# EAGLE design Interconnect_board_limit_switches_v1p3 (EAGLE 9.4.2)
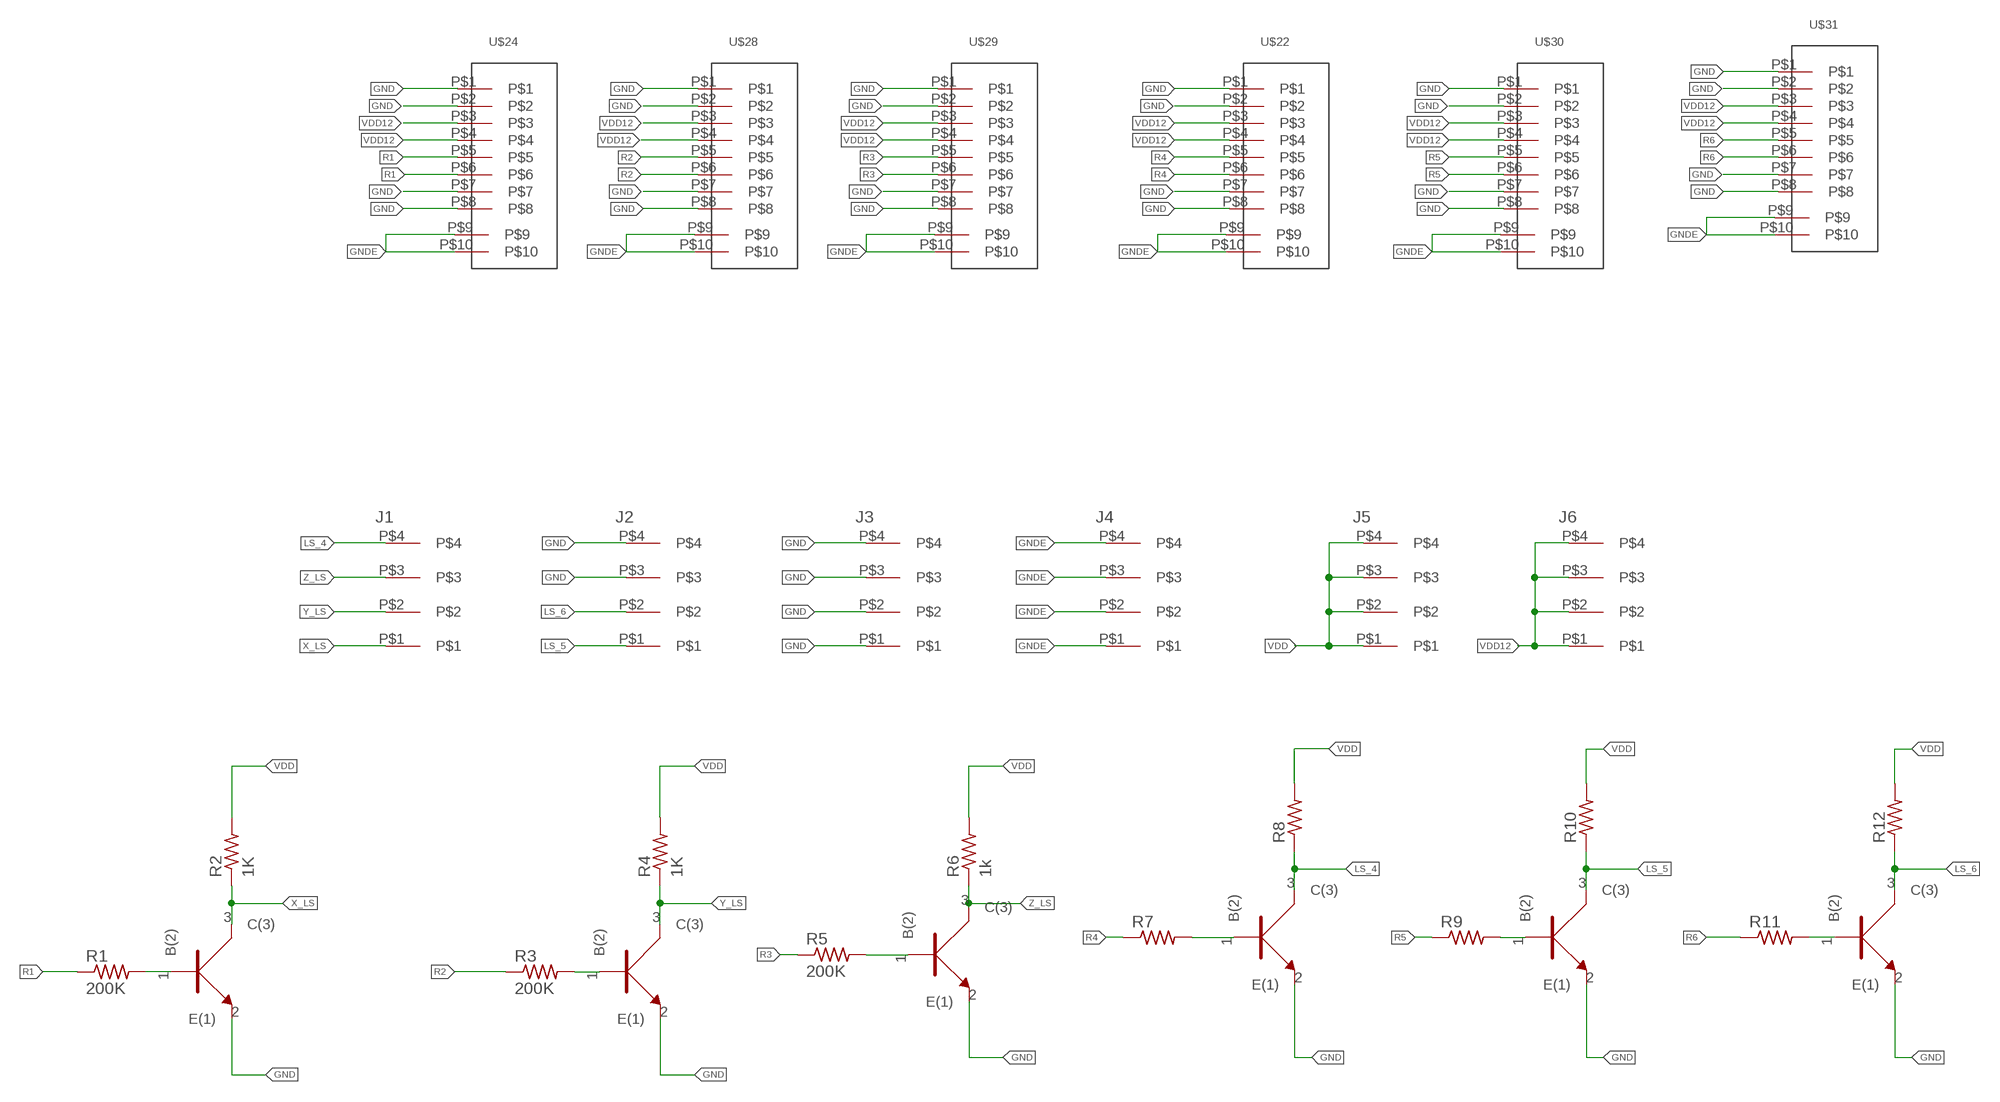
[diagram p0: schematic, sheet 1]

## Parts
J1  3.81MM_1_X_4_RT_ANGLE_PLUG_HEADER  [1X4_3.81MM_PITCH]
J2  3.81MM_1_X_4_RT_ANGLE_PLUG_HEADER  [1X4_3.81MM_PITCH]
J3  3.81MM_1_X_4_RT_ANGLE_PLUG_HEADER  [1X4_3.81MM_PITCH]
J4  3.81MM_1_X_4_RT_ANGLE_PLUG_HEADER  [1X4_3.81MM_PITCH]
J5  3.81MM_1_X_4_RT_ANGLE_PLUG_HEADER  [1X4_3.81MM_PITCH]
J6  3.81MM_1_X_4_RT_ANGLE_PLUG_HEADER  [1X4_3.81MM_PITCH]
R1  200K  R_0805  [0805]
R2  1K  R_0805  [0805]
R3  200K  R_0805  [0805]
R4  1K  R_0805  [0805]
R5  200K  R_0805  [0805]
R6  1k  R_0805  [0805]
R7  R_0805  [0805]
R8  R_0805  [0805]
R9  R_0805  [0805]
R10  R_0805  [0805]
R11  R_0805  [0805]
R12  R_0805  [0805]
U1  BC846BW  [SOT323]
U2  BC846BW  [SOT323]
U3  BC846BW  [SOT323]
U4  BC846BW  [SOT323]
U5  BC846BW  [SOT323]
U6  BC846BW  [SOT323]
U$22  RJ45_SMTRJ  [RJ45_SMT]
U$24  RJ45_SMTRJ  [RJ45_SMT]
U$28  RJ45_SMTRJ  [RJ45_SMT]
U$29  RJ45_SMTRJ  [RJ45_SMT]
U$30  RJ45_SMTRJ  [RJ45_SMT]
U$31  RJ45_SMTRJ  [RJ45_SMT]

## Nets
GND: J2.P$3 J2.P$4 J3.P$1 J3.P$2 J3.P$3 J3.P$4 U1.2(E(1)) U2.2(E(1)) U3.2(E(1)) U4.2(E(1)) U5.2(E(1)) U6.2(E(1)) U$22.P$1 U$22.P$2 U$22.P$7 U$22.P$8 U$24.P$1 U$24.P$2 U$24.P$7 U$24.P$8 U$28.P$1 U$28.P$2 U$28.P$7 U$28.P$8 U$29.P$1 U$29.P$2 U$29.P$7 U$29.P$8 U$30.P$1 U$30.P$2 U$30.P$7 U$30.P$8 U$31.P$1 U$31.P$2 U$31.P$7 U$31.P$8
GNDE: J4.P$1 J4.P$2 J4.P$3 J4.P$4 U$22.P$9 U$22.P$10 U$24.P$9 U$24.P$10 U$28.P$9 U$28.P$10 U$29.P$9 U$29.P$10 U$30.P$9 U$30.P$10 U$31.P$9 U$31.P$10
LS_4: J1.P$4 R8.1 U4.3(C(3))
LS_5: J2.P$1 R10.1 U5.3(C(3))
LS_6: J2.P$2 R12.1 U6.3(C(3))
N$1: R1.2 U1.1(B(2))
N$5: R3.2 U2.1(B(2))
N$11: R5.2 U3.1(B(2))
N$17: R7.2 U4.1(B(2))
N$22: R9.2 U5.1(B(2))
N$27: R11.2 U6.1(B(2))
R1: R1.1 U$24.P$5 U$24.P$6
R2: R3.1 U$28.P$5 U$28.P$6
R3: R5.1 U$29.P$5 U$29.P$6
R4: R7.1 U$22.P$5 U$22.P$6
R5: R9.1 U$30.P$5 U$30.P$6
R6: R11.1 U$31.P$5 U$31.P$6
VDD: J5.P$1 J5.P$2 J5.P$3 J5.P$4 R2.2 R4.2 R6.2 R8.2 R10.2 R12.2
VDD12: J6.P$1 J6.P$2 J6.P$3 J6.P$4 U$22.P$3 U$22.P$4 U$24.P$3 U$24.P$4 U$28.P$3 U$28.P$4 U$29.P$3 U$29.P$4 U$30.P$3 U$30.P$4 U$31.P$3 U$31.P$4
X_LS: J1.P$1 R2.1 U1.3(C(3))
Y_LS: J1.P$2 R4.1 U2.3(C(3))
Z_LS: J1.P$3 R6.1 U3.3(C(3))

## Library data of the parts
J1-J6 = 3D_MIG_Controller:3.81MM_1_X_4_RT_ANGLE_PLUG_HEADER
R1-R12 = 3D_MIG_Controller:R_0805
U1-U6 = 3D_MIG_Controller:BC846BW; MANUFACTURER_PART_NUMBER: BC846BW; VENDOR: Nexperia
U$22 U$24 U$28-U$31 = 3D_MIG_Controller:RJ45_SMT

## Board
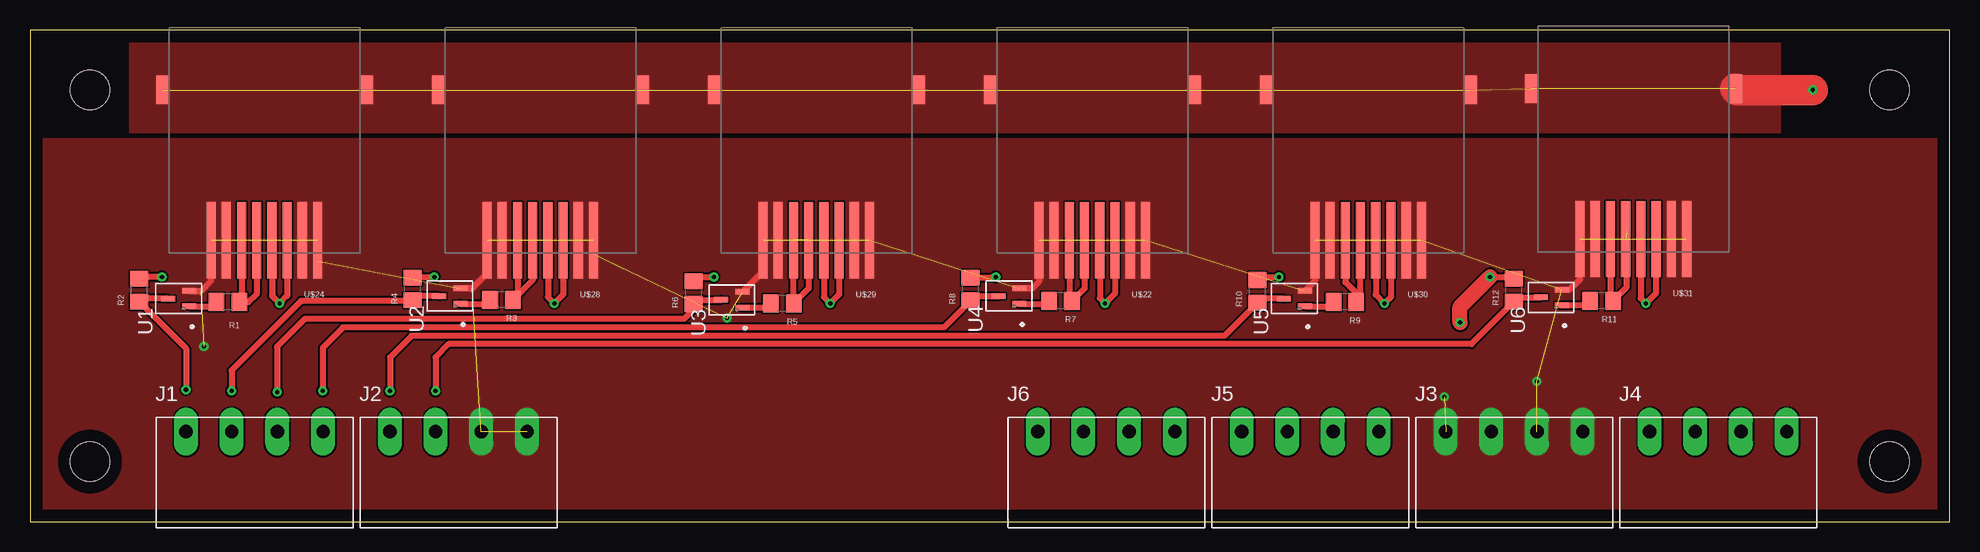
[diagram p1: board, top side]
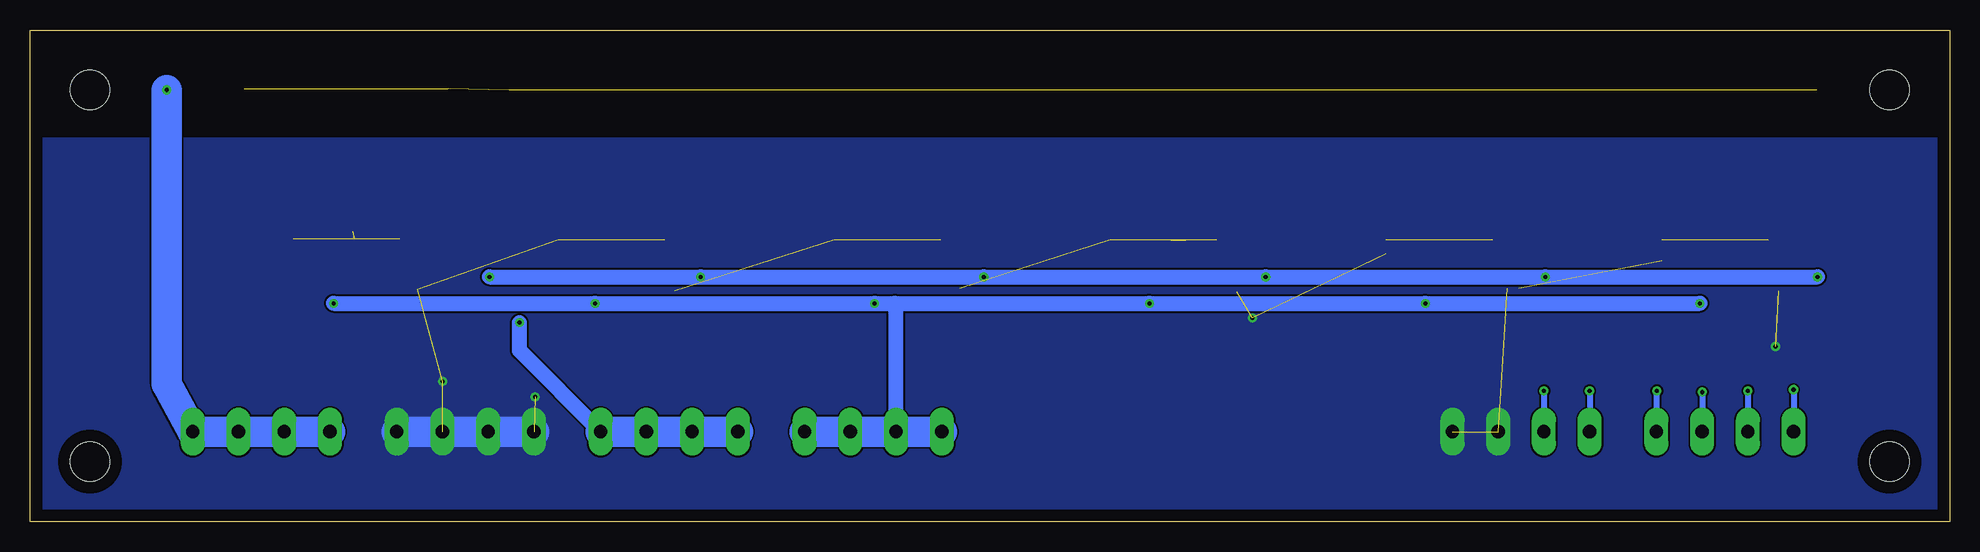
[diagram p2: board, bottom side, seen from below]

Size 160 x 41 mm. Coordinates in mm from the lower left corner, seen from the top.
Outline: 0,0 160,0 160,41 0,41 0,0
Copper layers (1*16): Top 0.035mm / dielectric 1.5mm / Bottom 0.035mm
Design rules "default": minimum track width 6mil, minimum drill 0.35mm, track to track 6mil, track to pad 6mil, pad to pad 6mil, via to via 6mil, smd to smd 6mil, copper to edge 40mil, drill to drill 6mil, minimum pad ring 10mil, minimum via ring 8mil, stop-mask expansion 4mil, vias tented up to drill 0mil, thermal gap 10mil
Holes 3.3 mm at 5,36 5,5 155,5 155,36

### Footprints (pad centres in the part's own frame; a part is rotated, then mirrored left to right if it is on the bottom)
1X4_3.81MM_PITCH = drill 1.1 pad 2 long: P$1 0,0; P$2 3.81,0; P$3 7.62,0; P$4 11.43,0
0805 = smd 1.3 x 1.5: 1 -0.95,0; 2 0.95,0
SOT323 = smd 0.457 x 1.168: 1 -0.65,-0.876; 2 0.65,-0.876; 3 0,0.876
RJ45_SMT = smd 0.76 x 6.35: P$1 -3.18,8.94; P$2 -1.91,8.94; P$3 -0.64,8.94; P$4 0.63,8.94; P$5 1.9,8.94; P$6 3.17,8.94; P$7 4.44,8.94; P$8 5.71,8.94 | smd 1.1 x 2.4: P$9 -7.25,-3.6; P$10 9.75,-3.6

### Placement (x,y rotation side)
J1  13,7.5 0 top
J2  30,7.5 0 top
J3  118,7.5 0 top
J4  135,7.5 0 top
J5  101,7.5 0 top
J6  84,7.5 0 top
R1  16.5,18.3 180 top
R2  9.1,19.3 90 top
R3  39.3,18.5 180 top
R4  31.9,19.4 90 top
R5  62.7,18.2 180 top
R6  55.3,19.1 90 top
R7  85.9,18.4 180 top
R8  78.4,19.4 90 top
R9  109.6,18.3 180 top
R10  102.3,19.2 90 top
R11  131,18.4 180 top
R12  123.7,19.3 90 top
U1  12.4,18.6 90 top
U2  35,18.8 90 top
U3  58.5,18.5 90 top
U4  81.6,18.8 90 top
U5  105.4,18.6 90 top
U6  126.8,18.7 90 top
U$22  89.8,32.4 180 top
U$24  20.8,32.4 180 top
U$28  43.8,32.4 180 top
U$29  66.8,32.4 180 top
U$30  112.8,32.4 180 top
U$31  134.9,32.5 180 top

### Tracks (layer width: path | path; a pad name or v marks a point on that pad's centre or on a via)
GND  (via drill 0.35)  (30 unrouted)
  Top 0.152: U$28.P$1 46.98,22.32 | U$24.P$1 23.98,21.72 | U$30.P$8 107.09,20.39 | U$31.P$8 129.19,21.39
  Top 0.508: U$30.P$8 107.09,20.06 U5.2 | U6.2 128.35,19.35 129.19,20.19 U$31.P$8 | U3.2 61.09,20.86 U$29.P$8 | U1.2 14.25,19.25 15.09,20.09 U$24.P$8 15.09,24.7 | U$28.P$8 38.09,20.69 36.85,19.45 U2.2 | U$22.P$8 84.09,19.99 83.55,19.45 U4.2 | U$29.P$1 69.98,25.5 | U$30.P$1 115.98,23.6
  Bottom 2.54: J3.P$1 J3.P$2 J3.P$3 J3.P$4
  other vias: 125.6,11.7 117.9,10.4 14.5,14.6 58.1,16.98
  pour Top (no thermals): 0,32 160,32 160,0 0,0
  pour Bottom (no thermals): 0,32 160,32 160,0 0,0
GNDE  (via drill 0.35)  (11 unrouted)
  Top 2.54: v148.6,36 142.25,36 U$31.P$9
  Bottom 2.54: J4.P$1 J4.P$2 J4.P$3 J4.P$4 148.6,11.47 v148.6,36
  pour Top (no thermals): 8.3,40 145.9,40 145.9,32.4 8.3,32.4
LS_4  (via drill 0.35)
  Top 0.508: U4.3 78.75,18.8 R8.1 78.4,18.4 76.2,16.2 26.1,16.2 24.4,14.5 v24.4,10.9
  Bottom 0.508: v24.4,10.9 24.43,10.87 J1.P$4
LS_5  (via drill 0.35)
  Top 0.508: U5.3 102.65,18.6 R10.1 99.55,15.5 31.8,15.5 30,13.7 v30,10.9
  Bottom 0.508: v30,10.9 J2.P$1
LS_6  (via drill 0.35)
  Top 0.508: U6.3 124.05,18.7 R12.1 120.15,14.8 34.9,14.8 33.8,13.7 v33.8,10.9
  Bottom 0.508: v33.8,10.9 J2.P$2
N$1
  Top 0.508: U1.1 15.2,17.95 R1.2
N$5
  Top 0.508: U2.1 38,18.15 R3.2
N$11
  Top 0.508: U3.1 61.4,17.85 R5.2
N$17
  Top 0.508: U4.1 84.7,18.15 R7.2
N$22
  Top 0.508: U5.1 108.3,17.95 R9.2
N$27
  Top 0.508: U6.1 129.7,18.05 R11.2
R1
  Top 0.508: 19,23.36 U$24.P$5 18.9,19 18.2,18.3 R1.1 17.63,18.48 U$24.P$6
R2
  Top 0.508: U$28.P$6 40.63,18.88 R3.1 41.9,20.15 U$28.P$5
R3  (1 unrouted)
  Top 0.508: 63.7,25.5 63.65,25.45 R5.1 64.9,19.45 U$29.P$5
R4
  Top 0.508: U$22.P$6 86.63,18.62 R7.1 87.9,19.45 U$22.P$5
R5
  Top 0.508: U$30.P$5 110.9,18.65 R9.1 110.55,19.05 109.63,19.97 U$30.P$6
R6  (1 unrouted)
  Top 0.508: 131.7,23.53 U$31.P$6 131.73,18.62 R11.1 133.1,19.55 133.1,24.2
VDD  (via drill 0.35)
  Top 0.508: v11,20.4 9.25,20.4 R2.2 | R4.2 31.95,20.4 v33.7,20.4 | R6.2 55.65,20.4 v57,20.4 | R8.2 80.45,20.35 v80.5,20.4 | R10.2 102.55,20.4 v104.1,20.4 | v121.7,20.4 123.55,20.4 R12.2
  Top 1.27: v119.2,16.6 119.2,17.9 v121.7,20.4
  Bottom 1.27: v121.7,20.4 v104.1,20.4 v80.5,20.4 v57,20.4 v33.7,20.4 v11,20.4 | J5.P$4 119.2,14.27 v119.2,16.6
  Bottom 2.54: J5.P$1 J5.P$2 J5.P$3 J5.P$4
VDD12  (via drill 0.35)
  Top 0.508: U$31.P$4 134.27,18.63 v134.7,18.2 135.54,19.04 U$31.P$3 | U$30.P$4 112.17,18.93 v112.9,18.2 113.44,18.74 U$30.P$3 | U$22.P$4 89.17,18.63 v89.6,18.2 90.44,19.04 U$22.P$3 | U$29.P$4 66.17,18.73 v66.7,18.2 67.44,18.94 U$29.P$3 | U$28.P$4 43.17,18.73 v43.7,18.2 44.44,18.94 U$28.P$3 | U$24.P$4 20.17,18.83 v20.8,18.2 21.44,18.84 U$24.P$3
  Bottom 1.27: v134.7,18.2 v112.9,18.2 v89.6,18.2 87.9,18.2 | 87.9,18.2 v66.7,18.2 v43.7,18.2 v20.8,18.2 | J6.P$2 87.81,18.11 87.9,18.2
  Bottom 2.54: J6.P$1 J6.P$2 J6.P$3 J6.P$4
X_LS  (via drill 0.35)
  Top 0.508: U1.3 9.35,18.6 R2.1 13,14.45 v13,11
  Bottom 0.508: v13,11 J1.P$1
Y_LS  (via drill 0.35)
  Top 0.508: U2.3 32.25,18.8 R4.1 31.9,18.4 22.6,18.4 16.8,12.6 v16.8,10.9
  Bottom 0.508: v16.8,10.9 v16.81,10.89 J1.P$2
Z_LS  (via drill 0.35)
  Top 0.508: U3.3 55.65,18.5 R6.1 55.3,17.7 54.5,16.9 22.9,16.9 20.6,14.6 v20.6,10.8
  Bottom 0.508: v20.6,10.8 20.62,10.78 J1.P$3